# EAGLE design Interconnect_board_v1p1 (EAGLE 9.3.0)
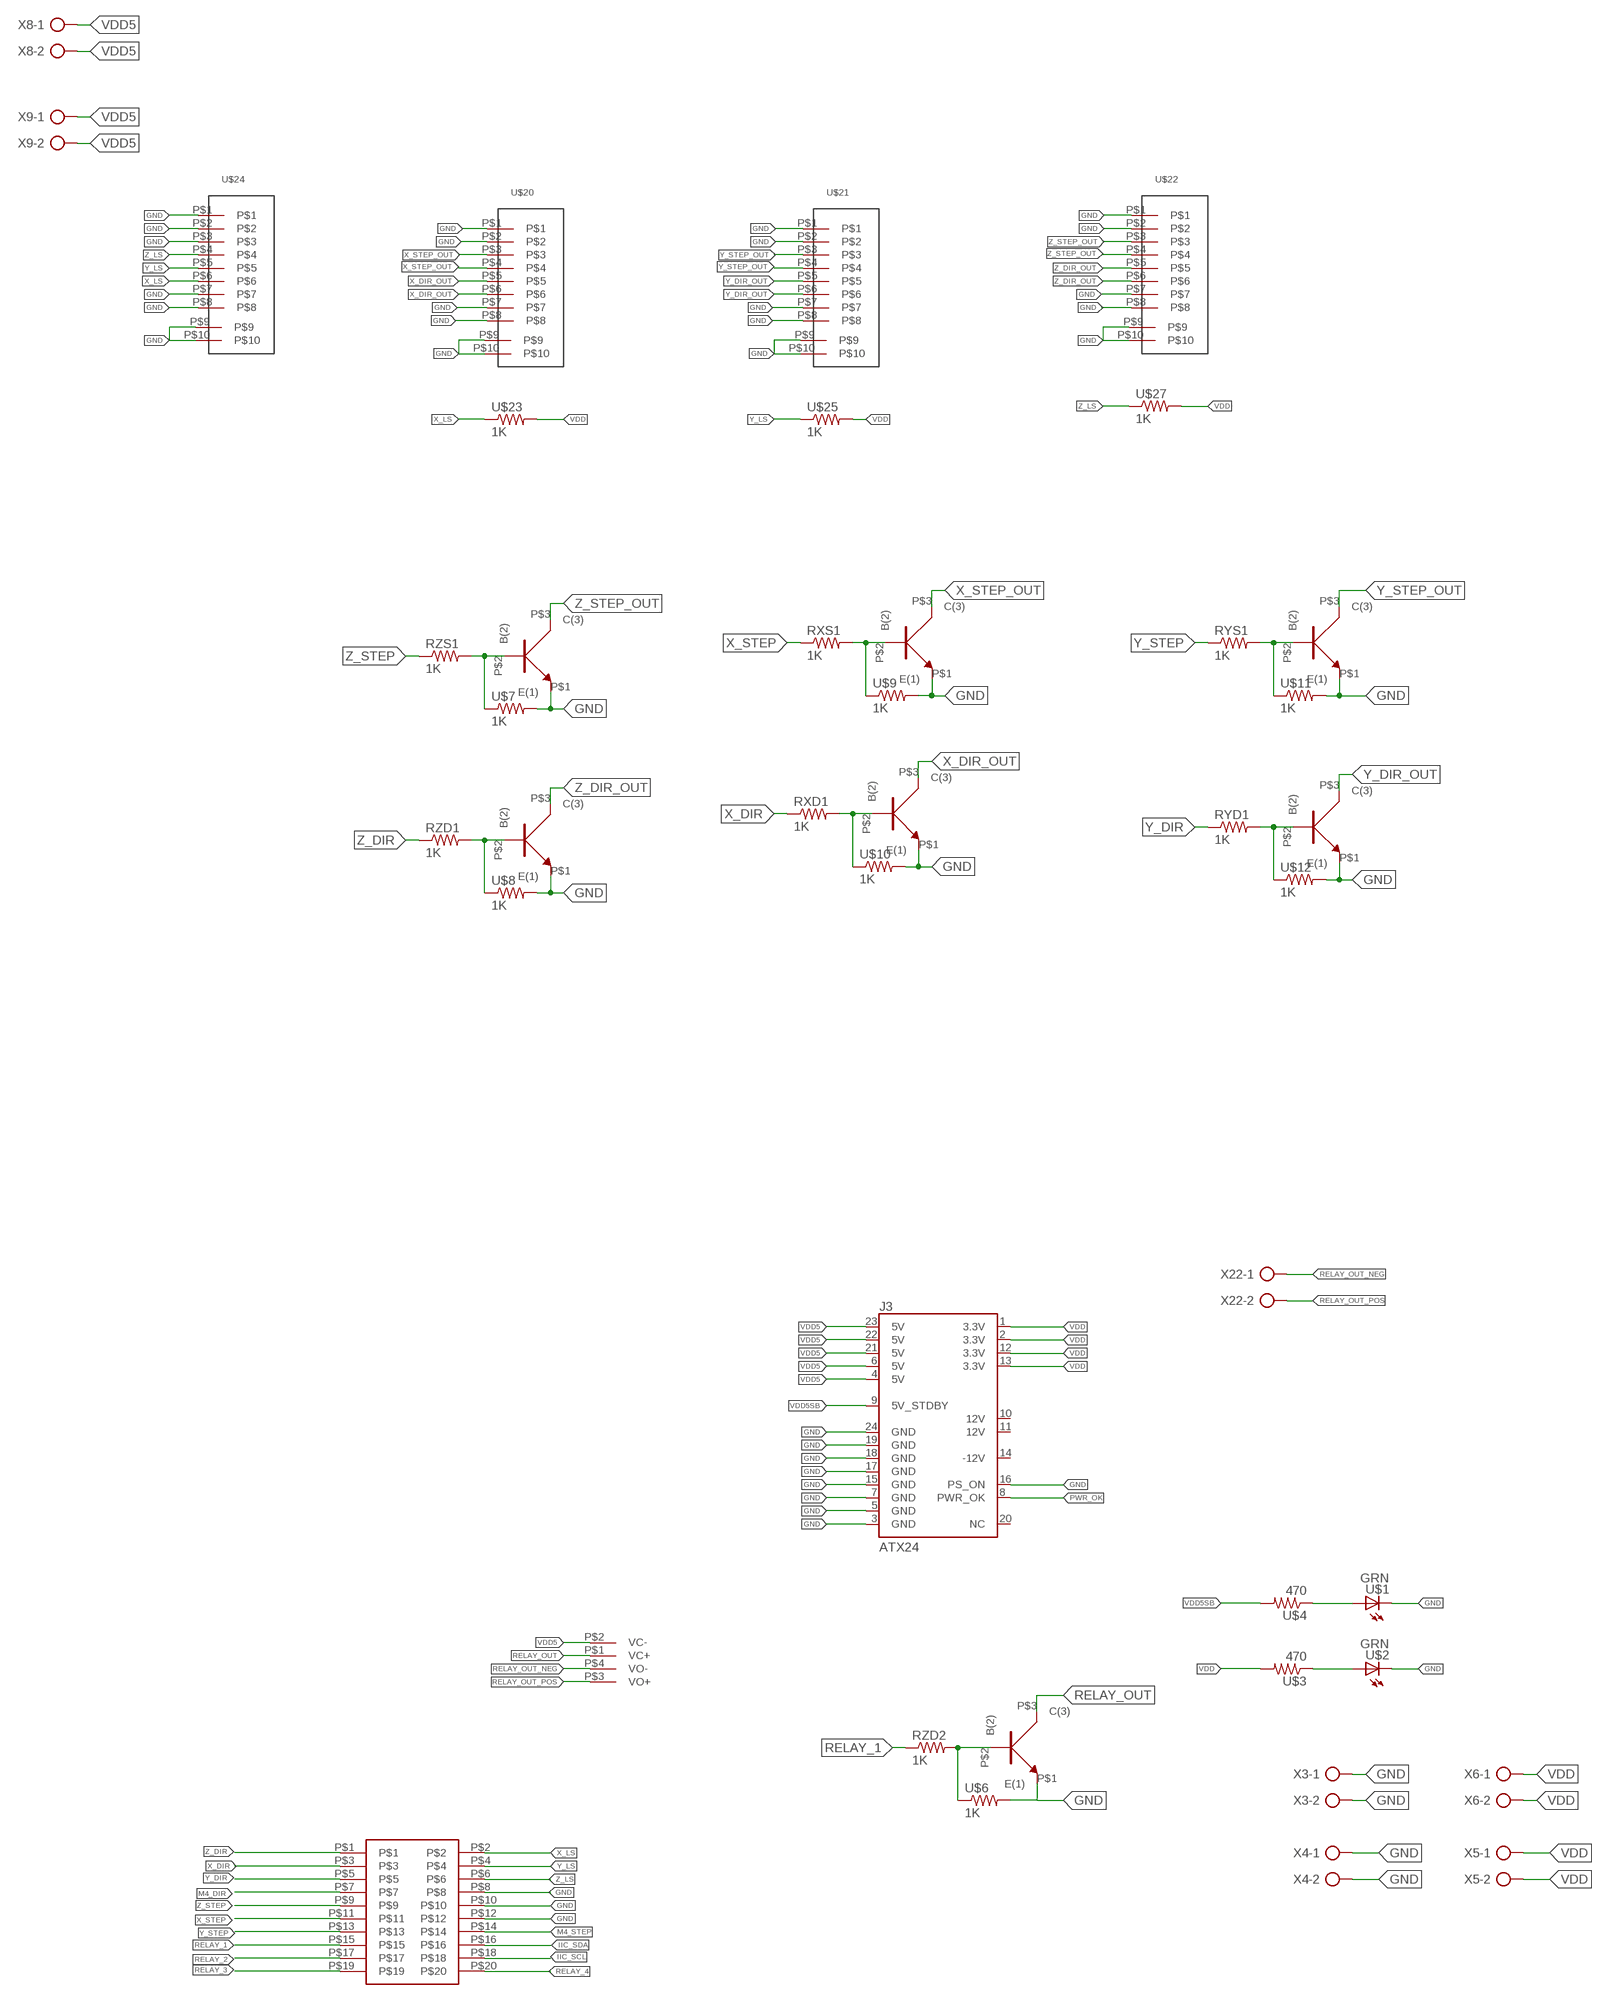
[diagram p0: schematic, sheet 1]

## Parts
J3  ATX24  [ATX24_STRAIGHT]
RXD1  R_0805_1K  [R_0805_1K]
RXS1  R_0805_1K  [R_0805_1K]
RYD1  R_0805_1K  [R_0805_1K]
RYS1  R_0805_1K  [R_0805_1K]
RZD1  R_0805_1K  [R_0805_1K]
RZD2  R_0805_1K  [R_0805_1K]
RZS1  R_0805_1K  [R_0805_1K]
U$1  LED_0805_GREEN  [LED_0805_GREEN]
U$2  LED_0805_GREEN  [LED_0805_GREEN]
U$3  R_0805_470  [R_0805_470]
U$4  R_0805_470  [R_0805_470]
U$5  RELAY_KYOTO_KF0604D  [RELAY_KYOTO_KF0604D]
U$6  R_0805_1K  [R_0805_1K]
U$7  R_0805_1K  [R_0805_1K]
U$8  R_0805_1K  [R_0805_1K]
U$9  R_0805_1K  [R_0805_1K]
U$10  R_0805_1K  [R_0805_1K]
U$11  R_0805_1K  [R_0805_1K]
U$12  R_0805_1K  [R_0805_1K]
U$13  TRANS_NPN  [TO_92_STRAIGHT]
U$14  TRANS_NPN  [TO_92_STRAIGHT]
U$15  TRANS_NPN  [TO_92_STRAIGHT]
U$16  TRANS_NPN  [TO_92_STRAIGHT]
U$17  TRANS_NPN  [TO_92_STRAIGHT]
U$18  TRANS_NPN  [TO_92_STRAIGHT]
U$19  TRANS_NPN  [TO_92_STRAIGHT]
U$20  RJ45_SMTRJ  [RJ45_SMT]
U$21  RJ45_SMTRJ  [RJ45_SMT]
U$22  RJ45_SMTRJ  [RJ45_SMT]
U$23  R_0805_1K  [R_0805_1K]
U$24  RJ45_SMTRJ  [RJ45_SMT]
U$25  R_0805_1K  [R_0805_1K]
U$26  2_X_10_HEADER_GENERIC  [2_X_10_.1_INCH]
U$27  R_0805_1K  [R_0805_1K]
X3  AK300/2  [AK300/2]
X4  AK300/2  [AK300/2]
X5  AK300/2  [AK300/2]
X6  AK300/2  [AK300/2]
X8  AK300/2  [AK300/2]
X9  AK300/2  [AK300/2]
X22  AK300/2  [AK300/2]

## Nets
GND: J3.3(GND) J3.5(GND) J3.7(GND) J3.15(GND) J3.16(PS_ON) J3.17(GND) J3.18(GND) J3.19(GND) J3.24(GND) U$1.C U$2.C U$6.2 U$7.2 U$8.2 U$9.2 U$10.2 U$11.2 U$12.2 U$13.P$1(E(1)) U$14.P$1(E(1)) U$15.P$1(E(1)) U$16.P$1(E(1)) U$17.P$1(E(1)) U$18.P$1(E(1)) U$19.P$1(E(1)) U$20.P$1 U$20.P$2 U$20.P$7 U$20.P$8 U$20.P$9 U$20.P$10 U$21.P$1 U$21.P$2 U$21.P$7 U$21.P$8 U$21.P$9 U$21.P$10 U$22.P$1 U$22.P$2 U$22.P$7 U$22.P$8 U$22.P$9 U$22.P$10 U$24.P$1 U$24.P$2 U$24.P$3 U$24.P$7 U$24.P$8 U$24.P$9 U$24.P$10 U$26.P$8 U$26.P$10 U$26.P$12 X3.1 X3.2 X4.1 X4.2
IIC_SCL: U$26.P$18
IIC_SDA: U$26.P$16
M4_DIR: U$26.P$7
M4_STEP: U$26.P$14
N$1: RXS1.2 U$9.1 U$15.P$2(B(2))
N$3: RZD1.2 U$8.1 U$14.P$2(B(2))
N$4: U$1.A U$4.1
N$5: U$2.A U$3.1
N$7: RZS1.2 U$7.1 U$13.P$2(B(2))
N$8: RZD2.2 U$6.1 U$19.P$2(B(2))
N$9: RYS1.2 U$11.1 U$18.P$2(B(2))
N$15: RXD1.2 U$10.1 U$16.P$2(B(2))
N$18: RYD1.2 U$12.1 U$17.P$2(B(2))
PWR_OK: J3.8(PWR_OK)
RELAY_1: RZD2.1 U$26.P$15
RELAY_2: U$26.P$17
RELAY_3: U$26.P$19
RELAY_4: U$26.P$20
RELAY_OUT: U$5.P$1(VC+) U$19.P$3(C(3))
RELAY_OUT_NEG: U$5.P$4(VO-) X22.1
RELAY_OUT_POS: U$5.P$3(VO+) X22.2
VDD: J3.1(3.3V) J3.2(3.3V) J3.12(3.3V) J3.13(3.3V) U$3.2 U$23.2 U$25.2 U$27.2 X5.1 X5.2 X6.1 X6.2
VDD5: J3.4(5V) J3.6(5V) J3.21(5V) J3.22(5V) J3.23(5V) U$5.P$2(VC-) X8.1 X8.2 X9.1 X9.2
VDD5SB: J3.9(5V_STDBY) U$4.2
X_DIR: RXD1.1 U$26.P$3
X_DIR_OUT: U$16.P$3(C(3)) U$20.P$5 U$20.P$6
X_LS: U$23.1 U$24.P$6 U$26.P$2
X_STEP: RXS1.1 U$26.P$11
X_STEP_OUT: U$15.P$3(C(3)) U$20.P$3 U$20.P$4
Y_DIR: RYD1.1 U$26.P$5
Y_DIR_OUT: U$17.P$3(C(3)) U$21.P$5 U$21.P$6
Y_LS: U$24.P$5 U$25.1 U$26.P$4
Y_STEP: RYS1.1 U$26.P$13
Y_STEP_OUT: U$18.P$3(C(3)) U$21.P$3 U$21.P$4
Z_DIR: RZD1.1 U$26.P$1
Z_DIR_OUT: U$14.P$3(C(3)) U$22.P$5 U$22.P$6
Z_LS: U$24.P$4 U$26.P$6 U$27.1
Z_STEP: RZS1.1 U$26.P$9
Z_STEP_OUT: U$13.P$3(C(3)) U$22.P$3 U$22.P$4
Unconnected: J3.10(12V) J3.11(12V) J3.14(-12V) J3.20(NC)

## Library data of the parts
J3 = 3D_MIG_Controller:ATX24: ATX24 Pin Power Supply Connector - Right Angle PTH Mount This is a good connector for connecting a computer power supply to a PCB. It's massive, but provides many amps of power at 5V and 12V. SparkFun Products: SparkFun Benchtop Power Board Kit <https://www.sparkfun.com/products/12867> SparkFun Power Driver Shield Kit <https://www.sparkfun.com/products/10618>
RXD1 RXS1 RYD1 RYS1 RZD1 RZD2 RZS1 U$6-U$12 U$23 U$25 U$27 = 3D_MIG_Controller:R_0805_1K
U$1 U$2 = 3D_MIG_Controller:LED_0805_GREEN
U$3 U$4 = 3D_MIG_Controller:R_0805_470
U$5 = 3D_MIG_Controller:RELAY_KYOTO_KF0604D
U$13-U$19 = 3D_MIG_Controller:TRANS_NPN
U$20-U$22 U$24 = 3D_MIG_Controller:RJ45_SMT
U$26 = 3D_MIG_Controller:2_X_10_HEADER_GENERIC
X3-X6 X8 X9 X22 = 3D_MIG_Controller:AK300/2: CONNECTOR; OC_FARNELL: unknown; OC_NEWARK: unknown

## Board
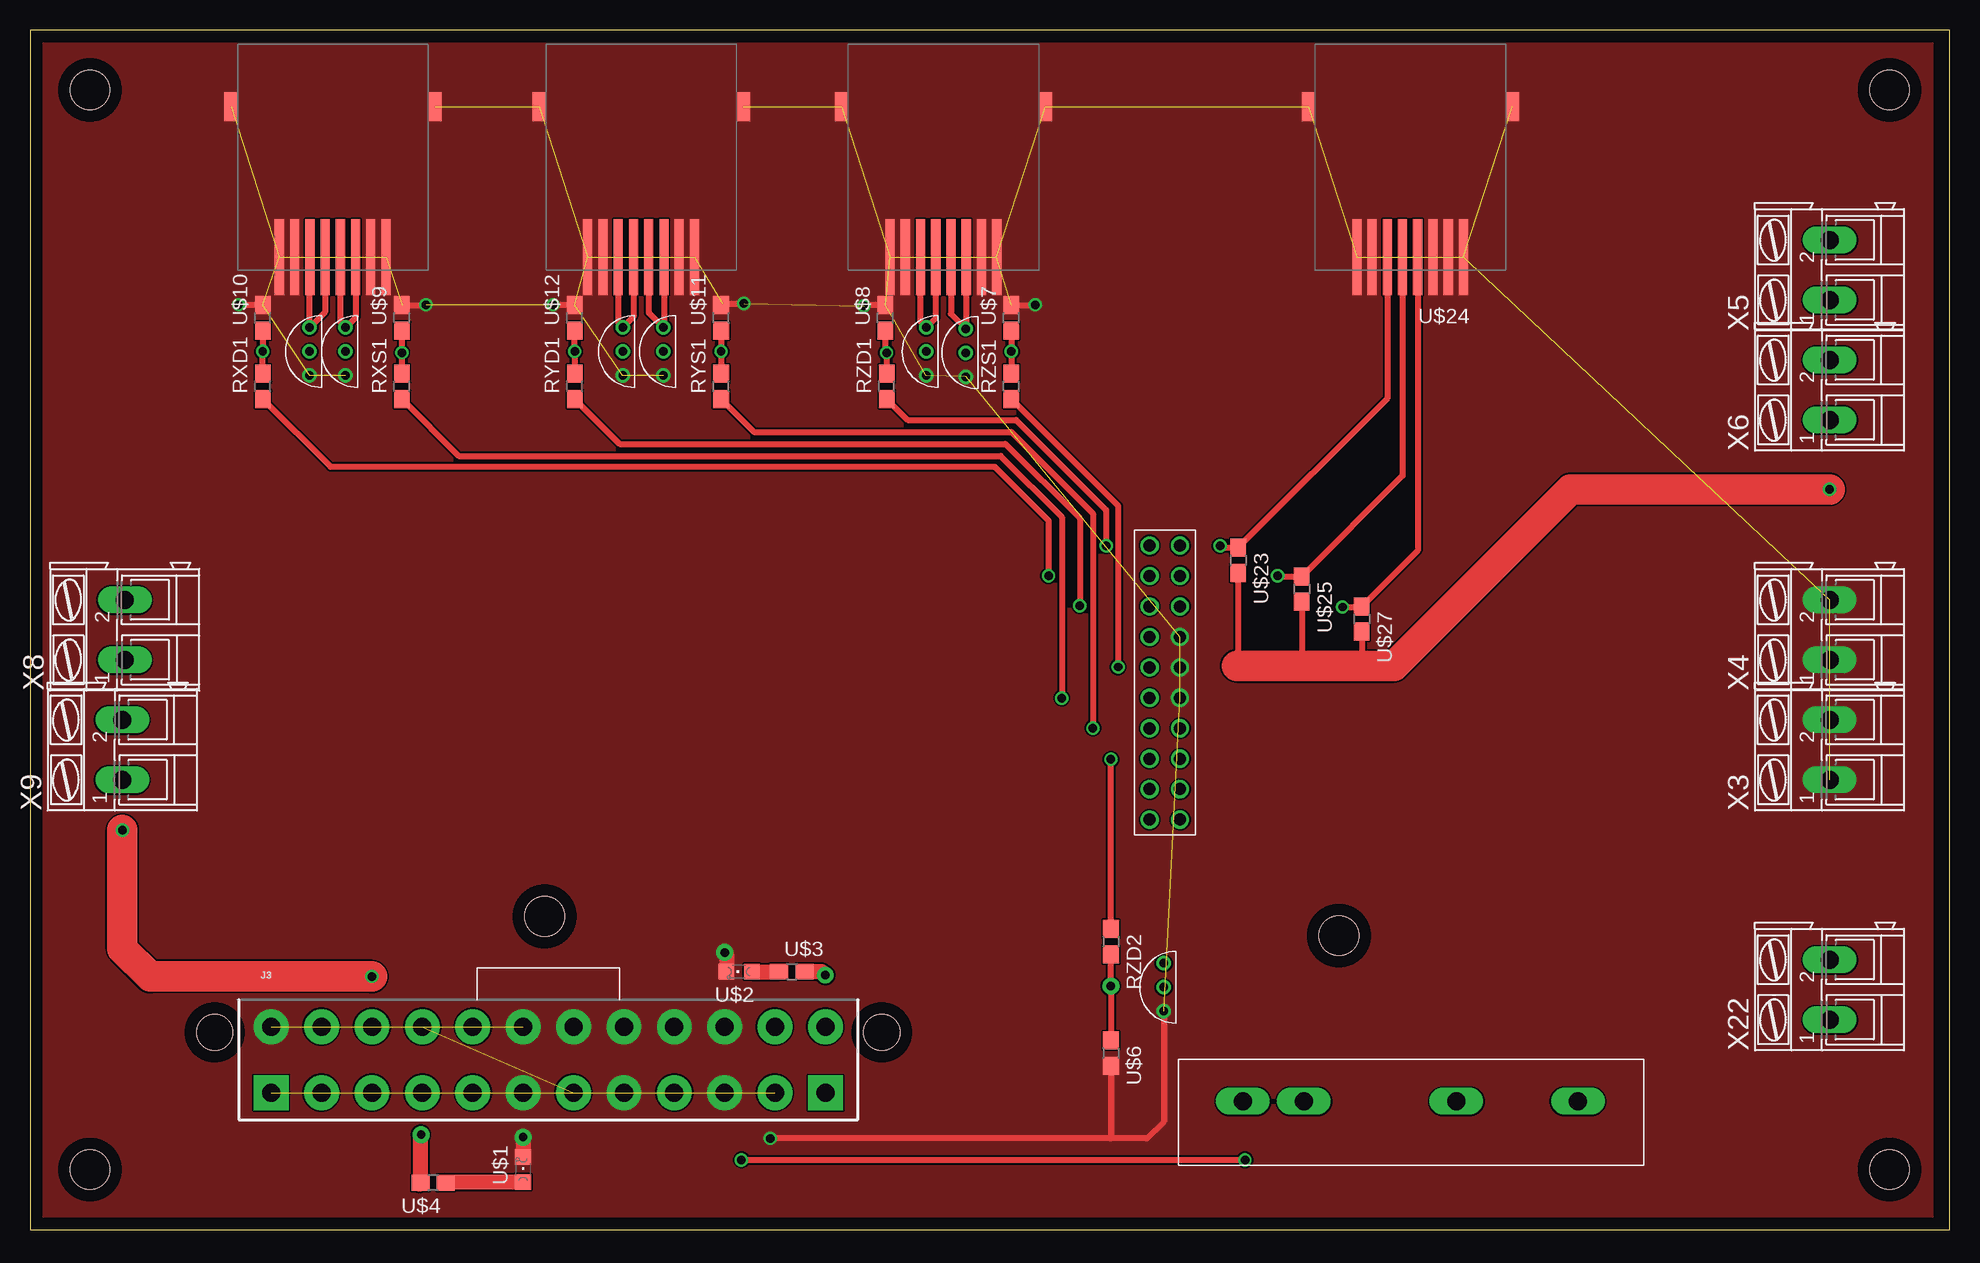
[diagram p1: board, top side]
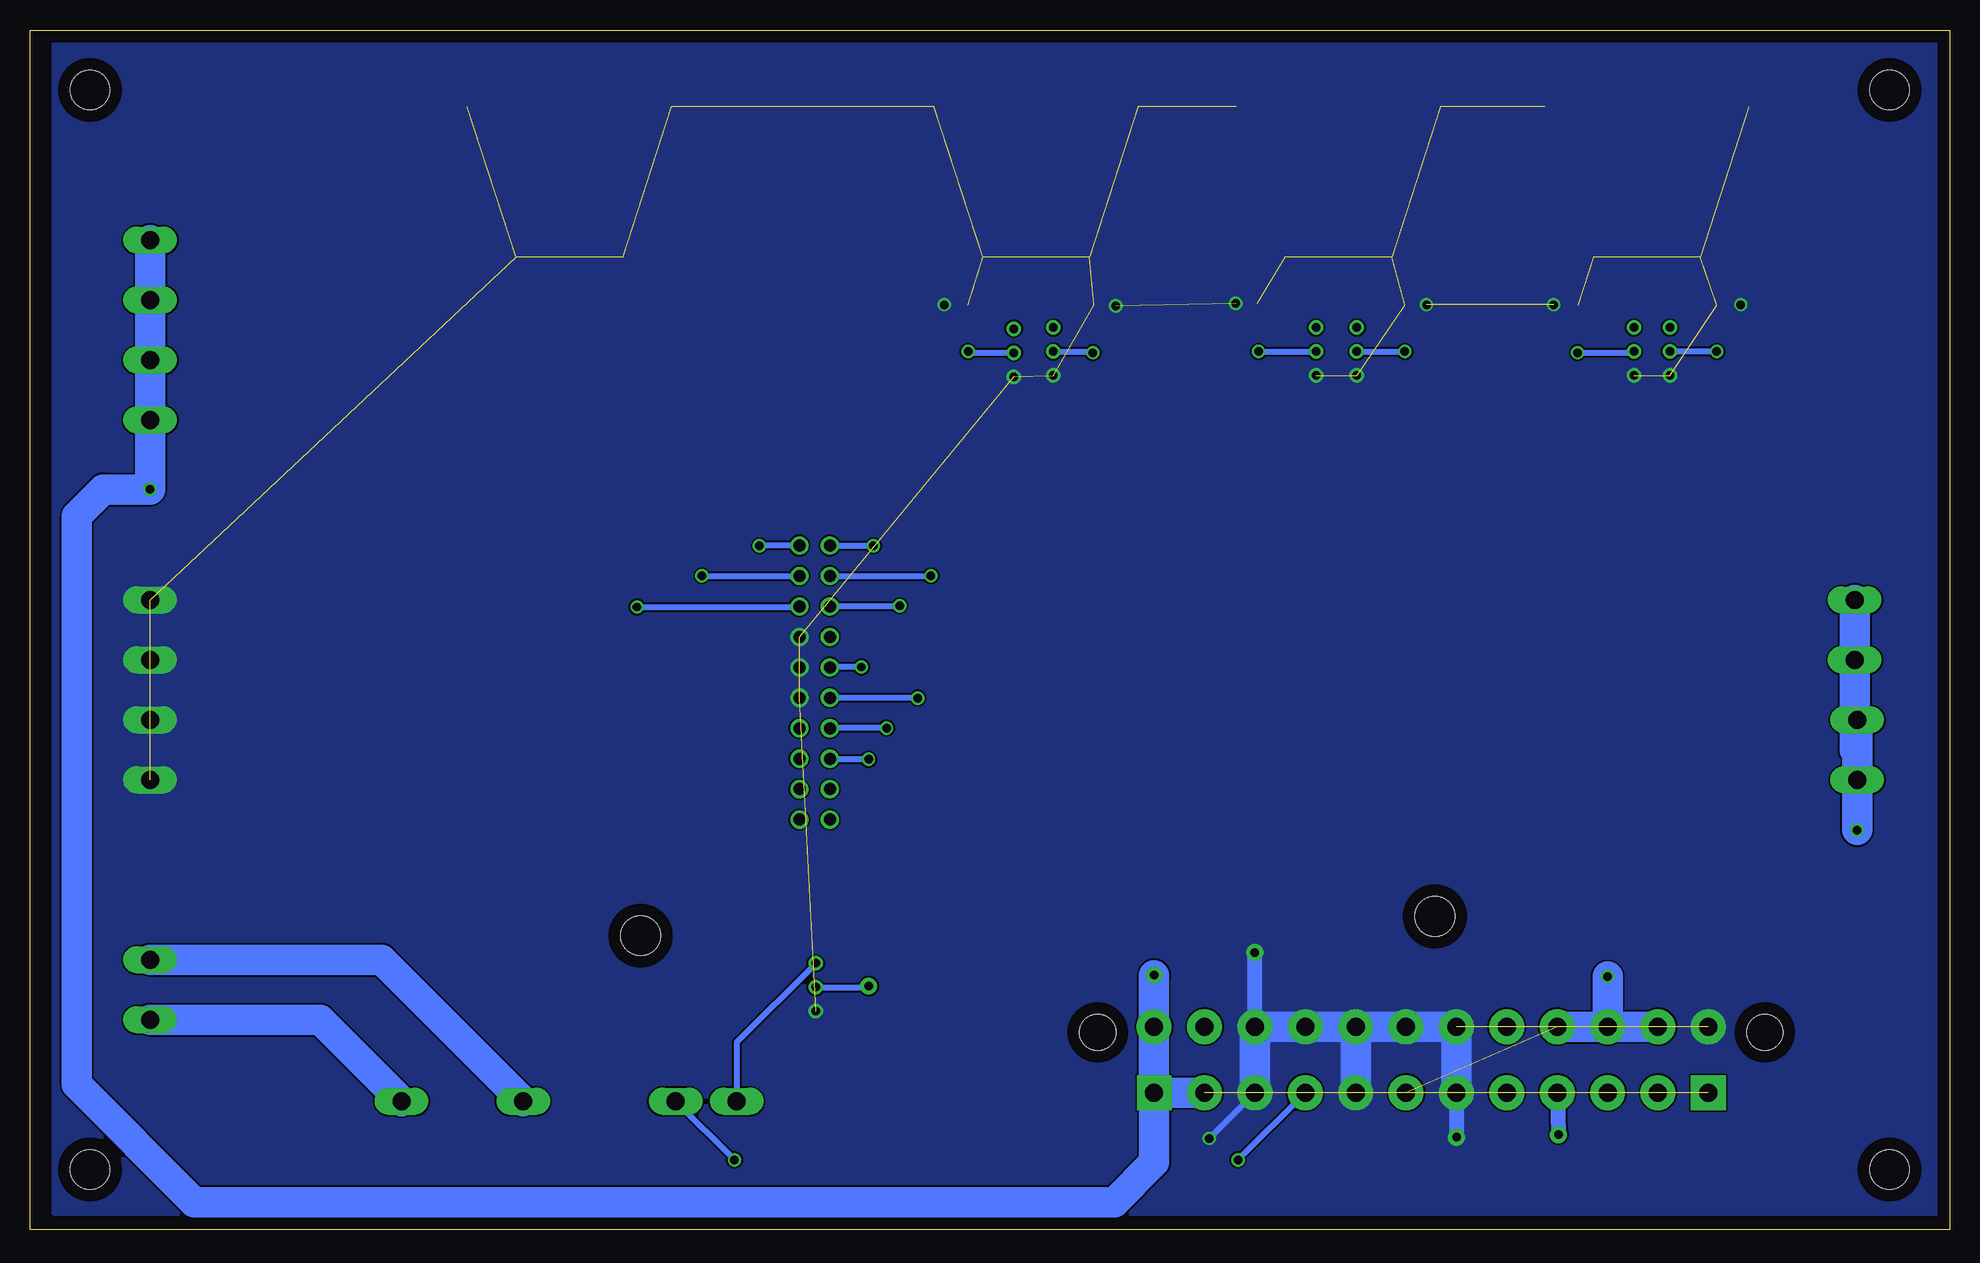
[diagram p2: board, bottom side, seen from below]

Size 160 x 100 mm. Coordinates in mm from the lower left corner, seen from the top.
Outline: 0,0 160,0 160,100 0,100 0,0
Copper layers (1*16): Top 0.035mm / dielectric 1.5mm / Bottom 0.035mm
Design rules "default": minimum track width 6mil, minimum drill 0.35mm, track to track 6mil, track to pad 6mil, pad to pad 6mil, via to via 6mil, smd to smd 6mil, copper to edge 40mil, drill to drill 6mil, minimum pad ring 10mil, minimum via ring 8mil, stop-mask expansion 4mil, vias tented up to drill 0mil, thermal gap 10mil
Holes 3.3 mm at 5,95 5,5 155,5 155,95 42.9,26.1 109.1,24.5

### Footprints (pad centres in the part's own frame; a part is rotated, then mirrored left to right if it is on the bottom)
ATX24_STRAIGHT = drill 1.5 pad 2.9 square: 1 23.1,-5.5; 12 -23.1,-5.5 | drill 1.5 pad 2.9: 2 18.9,-5.5; 3 14.7,-5.5; 4 10.5,-5.5; 5 6.3,-5.5; 6 2.1,-5.5; 7 -2.1,-5.5; 8 -6.3,-5.5; 9 -10.5,-5.5; 10 -14.7,-5.5; 11 -18.9,-5.5; 13 23.1,0; 14 18.9,0; 15 14.7,0; 16 10.5,0; 17 6.3,0; 18 2.1,0; 19 -2.1,0; 20 -6.3,0; 21 -10.5,0; 22 -14.7,0; 23 -18.9,0; 24 -23.1,0 | hole 3: -27.8,-0.46; 27.8,-0.46
R_0805_1K = smd 1.5 x 1.3: 1 -1.052,0; 2 1.052,0
LED_0805_GREEN = smd 1.3 x 1.3: A 0,-1.05; C 0,1.05
R_0805_470 = smd 1.5 x 1.3: 1 -1.052,0; 2 1.052,0
RELAY_KYOTO_KF0604D = drill 1.5 long: P$1 0,0; P$2 -5.08,0; P$3 -17.78,0; P$4 -27.94,0
TO_92_STRAIGHT = drill 0.7: P$1 -2,0; P$2 0,0; P$3 2,0
RJ45_SMT = smd 0.76 x 6.35: P$1 -3.18,8.94; P$2 -1.91,8.94; P$3 -0.64,8.94; P$4 0.63,8.94; P$5 1.9,8.94; P$6 3.17,8.94; P$7 4.44,8.94; P$8 5.71,8.94 | smd 1.1 x 2.4: P$9 -7.25,-3.6; P$10 9.75,-3.6
2_X_10_.1_INCH = drill 1: P$1 -11.43,-1.27; P$2 -11.43,1.27; P$3 -8.89,-1.27; P$4 -8.89,1.27; P$5 -6.35,-1.27; P$6 -6.35,1.27; P$7 -3.81,-1.27; P$8 -3.81,1.27; P$9 -1.27,-1.27; P$10 -1.27,1.27; P$11 1.27,-1.27; P$12 1.27,1.27; P$13 3.81,-1.27; P$14 3.81,1.27; P$15 6.35,-1.27; P$16 6.35,1.27; P$17 8.89,-1.27; P$18 8.89,1.27; P$19 11.43,-1.27; P$20 11.43,1.27
AK300/2 = drill 1.5 long: 1 -2.515,0; 2 2.489,0

### Placement (x,y rotation side)
J3  43.2,16.9 0 top
RXD1  19.4,70.3 90 top
RXS1  31,70.3 90 top
RYD1  45.4,70.3 90 top
RYS1  57.6,70.3 90 top
RZD1  71.4,70.3 90 top
RZD2  90.1,24 270 top
RZS1  81.8,70.3 90 top
U$1  41.1,5 0 top
U$2  59.1,21.5 90 top
U$3  63.5,21.5 0 top
U$4  33.6,3.9 180 top
U$5  101.1,10.7 180 top
U$6  90.1,14.7 270 top
U$7  81.8,76 90 top
U$8  71.3,76 90 top
U$9  31,76 90 top
U$10  19.4,76 90 top
U$11  57.6,76 90 top
U$12  45.4,76 90 top
U$13  78,73.1 90 top
U$14  74.7,73.2 90 top
U$15  26.3,73.2 90 top
U$16  23.3,73.2 90 top
U$17  49.4,73.2 90 top
U$18  52.8,73.2 90 top
U$19  94.5,20.2 90 top
U$20  26.5,90 180 top
U$21  52.2,90 180 top
U$22  77.4,90 180 top
U$23  100.7,55.8 270 top
U$24  116.3,90 180 top
U$25  106,53.4 270 top
U$26  94.6,45.6 270 top
U$27  111,50.9 270 top
X3  150,40 90 top
X4  150,50 90 top
X5  150,80 90 top
X6  150,70 90 top
X8  7.9,50 90 top
X9  7.7,40 90 top
X22  150,20 90 top

### Tracks (layer width: path | path; a pad name or v marks a point on that pad's centre or on a via)
GND  (via drill 0.7, 0.7 pad 1.4)  (45 unrouted)
  Top 0.508: 90.1,7.6 v61.7,7.6 | U$19.P$1 94.5,9 93.1,7.6 90.1,7.6 | U$6.2 90.1,7.6 | U$10.2 17.45,77.05 v17.4,77.1 | U$9.2 32.95,77.05 v33,77.1 | U$12.2 43.65,77.05 v43.6,77.1 | U$11.2 57.75,77.2 v59.5,77.2 | U$8.2 69.55,77.05 v69.5,77 | U$7.2 83.75,77.05 v83.8,77.1
  Top 1.27: v41.1,7.7 U$1.C | v57.9,23.1 58.05,22.95 U$2.C
  Bottom 0.508: v61.7,7.6 J3.3
  Bottom 1.27: J3.7 v41.1,7.7 | J3.15 v57.9,23.1
  Bottom 2.54: J3.3 J3.15 J3.16 J3.17 | J3.5 J3.17 | J3.7 J3.19 J3.18 J3.17
  pour Bottom (no thermals): 0.6,99.5 158,99.5 158,1.4 0.6,1.4
  pour Top (no thermals): 0.8,99.2 158.4,99.2 158.4,1.1 0.8,1.1
N$1  (via drill 0.7)
  Top 0.508: RXS1.2 v31,73.1 U$9.1
  Bottom 0.508: v31,73.1 26.4,73.1 U$15.P$2
N$3  (via drill 0.7)
  Top 0.508: 71.4,74.75 U$8.1 71.3,73.2 v71.4,73.1 RZD1.2
  Bottom 0.508: U$14.P$2 71.5,73.2 v71.4,73.1
N$4
  Top 1.27: U$1.A 34.7,3.95 U$4.1
N$5
  Top 1.27: U$2.A U$3.1
N$7  (via drill 0.7)
  Top 0.508: U$7.1 v81.8,73.2 RZS1.2
  Bottom 0.508: v81.8,73.2 81.7,73.1 U$13.P$2
N$8  (via drill 0.7 pad 1.4)
  Top 0.508: U$6.1 v90.1,20.3 RZD2.2
  Bottom 0.508: U$19.P$2 90.2,20.2 v90.1,20.3
N$9  (via drill 0.7)
  Top 0.508: U$11.1 v57.6,73.2 RYS1.2
  Bottom 0.508: v57.6,73.2 U$18.P$2
N$15  (via drill 0.7)
  Top 0.508: RXD1.2 v19.4,73.2 U$10.1
  Bottom 0.508: v19.4,73.2 U$16.P$2
N$18  (via drill 0.7)
  Top 0.508: RYD1.2 v45.4,73.2 U$12.1
  Bottom 0.508: U$17.P$2 v45.4,73.2
RELAY_1  (via drill 0.7)
  Top 0.508: RZD2.1 v90.1,39.2
  Bottom 0.508: U$26.P$15 90.15,39.25 v90.1,39.2
RELAY_OUT
  Bottom 0.508: U$19.P$3 101.1,15.6 U$5.P$1
RELAY_OUT_NEG
  Bottom 2.54: X22.1 135.82,17.48 U$5.P$4
RELAY_OUT_POS
  Bottom 2.54: X22.2 130.67,22.49 U$5.P$3
VDD  (via drill 0.7, 0.7 pad 1.4)  (1 unrouted)
  Top 0.508: 100.6,47 100.7,47.1 U$23.2 | 106.1,47 106,47.1 U$25.2 | U$27.2 111,47
  Top 1.27: v66.3,21.2 66,21.5 U$3.2
  Top 2.54: v150,61.7 128.4,61.7 113.7,47 111,47 106.1,47 100.6,47
  Bottom 2.54: J3.1 J3.13 v66.3,21.2 | J3.2 J3.1 | J3.1 66.3,5.6 69.61,2.29 146.3,2.29 156.1,12.09 156.1,59.5 153.9,61.7 v150,61.7 X6.1 X6.2 X5.1 X5.2
VDD5  (via drill 0.7)  (2 unrouted)
  Top 0.508: v59.3,5.8 v101.28,5.8
  Top 2.54: v28.5,21.1 10,21.1 7.7,23.4 v7.7,33.3
  Bottom 0.508: J3.4 v59.3,5.8 | v101.28,5.8 U$5.P$2
  Bottom 2.54: J3.21 J3.22 | J3.23 J3.22 | J3.22 v28.5,21.1 | X8.2 X8.1 7.9,39.99 X9.2 X9.1 v7.7,33.3
VDD5SB  (via drill 0.7 pad 1.4)
  Top 1.27: 32.45,3.8 U$4.2 32.55,7.85 v32.6,7.9
  Bottom 1.27: J3.9 v32.6,7.9
X_DIR  (via drill 0.7)
  Top 0.508: RXD1.1 25.05,63.6 80.4,63.6 84.9,59.1 v84.9,54.5
  Bottom 0.508: U$26.P$3 v84.9,54.5
X_DIR_OUT
  Top 0.508: U$20.P$6 23.3,80.63 U$16.P$3 24.6,76.5 U$20.P$5
X_LS  (via drill 0.7)
  Top 0.508: v99.2,57 99.35,56.85 U$23.1 113.13,69.28 U$24.P$6
  Bottom 0.508: v99.2,57 99.16,57.04 99.15,57.03 U$26.P$2
X_STEP  (via drill 0.7)
  Top 0.508: RXS1.1 35.75,64.5 80.9,64.5 86,59.4 v86,44.3
  Bottom 0.508: 86.04,44.26 v86,44.3 93.3,44.3 U$26.P$11
X_STEP_OUT
  Top 0.508: U$20.P$4 25.87,75.63 U$15.P$3 27.14,76.04 U$20.P$3
Y_DIR  (via drill 0.7)
  Top 0.508: RYD1.1 49.15,65.5 81.3,65.5 87.5,59.3 v87.5,52
  Bottom 0.508: U$26.P$5 93.28,52 v87.5,52
Y_DIR_OUT
  Top 0.508: U$21.P$5 50.3,76.1 U$17.P$3 49.03,75.57 U$21.P$6
Y_LS  (via drill 0.7)
  Top 0.508: v104,54.5 104.05,54.45 U$25.1 114.4,62.85 U$24.P$5
  Bottom 0.508: v104,54.5 U$26.P$4
Y_STEP  (via drill 0.7)
  Top 0.508: RYS1.1 60.35,66.5 81.8,66.5 88.6,59.7 v88.6,41.8
  Bottom 0.508: v88.6,41.8 U$26.P$13
Y_STEP_OUT
  Top 0.508: U$21.P$4 51.57,76.43 U$18.P$3 52.84,75.24 U$21.P$3
Z_DIR  (via drill 0.7)
  Top 0.508: RZD1.1 73.15,67.5 82.2,67.5 89.7,60 v89.7,57
  Bottom 0.508: v89.7,57 93.3,57 U$26.P$1
Z_DIR_OUT
  Top 0.508: U$22.P$6 74.23,75.67 U$14.P$3 75.5,76 U$22.P$5
Z_LS  (via drill 0.7)
  Top 0.508: v109.4,51.9 110.95,51.9 U$27.1 115.67,56.62 U$24.P$4
  Bottom 0.508: 109.34,51.96 v109.4,51.9 95.92,51.9 U$26.P$6
Z_STEP  (via drill 0.7)
  Top 0.508: v90.7,46.9 90.7,60.35 RZS1.1
  Bottom 0.508: v90.7,46.9 93.3,46.9 U$26.P$9
Z_STEP_OUT
  Top 0.508: U$22.P$4 76.77,76.33 U$13.P$3 78.04,75.14 U$22.P$3